# EAGLE design sterileplate (EAGLE 9.5.2)
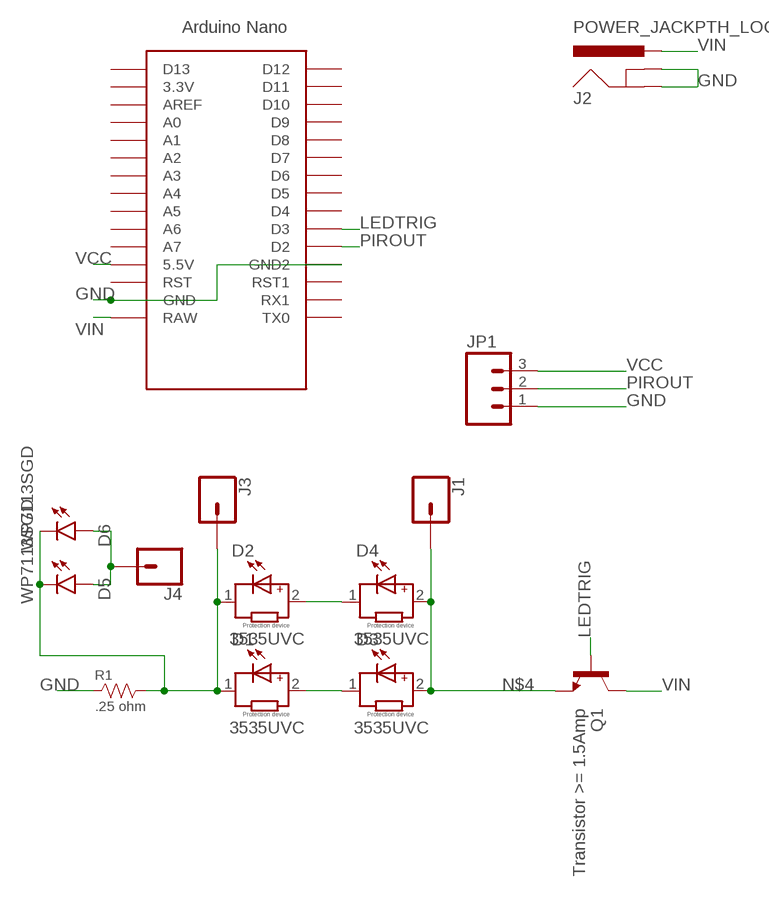
[diagram p0: schematic, sheet 1]

## Parts
D1  3535UVC  WL-SWTC_3535_158353060_6000K  [WL-SWTC_3535]
D2  3535UVC  WL-SWTC_3535_158353060_6000K  [WL-SWTC_3535]
D3  3535UVC  WL-SWTC_3535_158353060_6000K  [WL-SWTC_3535]
D4  3535UVC  WL-SWTC_3535_158353060_6000K  [WL-SWTC_3535]
D5  WP7113SGD  [RADIAL_5MM]
D6  WP7113SGD  [RADIAL_5MM]
J1  CONN_01PTH_2MM  [1X01_2MM]
J2  POWER_JACKPTH_LOCK  [POWER_JACK_PTH_LOCK]
J3  CONN_01PTH_2MM  [1X01_2MM]
J4  CONN_01PTH_2MM  [1X01_2MM]
JP1  M03PTH  [1X03]
Q1  Transistor >= 1.5Amp  TRANSISTOR_NPNTO92  [TO-92]
R1  .25 ohm  RESISTOR-AXL-REGULAR  [AXL-REGULAR]
U$1  NANO  [NANO]

## Nets
GND: J2.GND J2.GNDBREAK JP1.1 R1.1 U$1.GND U$1.GND1(GND2)
LEDTRIG: Q1.2(B) U$1.D3
N$1: D2.2 D4.1
N$2: D1.2 D3.1
N$4: D3.2 D4.2 J1.1 Q1.1(E)
N$6: D5.A D6.A J4.1
N$7: D1.1 D2.1 D5.C D6.C J3.1 R1.2
PIROUT: JP1.2 U$1.D2
VCC: JP1.3 U$1.5V(5.5V)
VIN: J2.PWR Q1.3(C) U$1.RAW
Unconnected: U$1.3.3V U$1.A0 U$1.A1 U$1.A2 U$1.A3 U$1.A4 U$1.A5 U$1.A6 U$1.A7 U$1.AREF U$1.D4 U$1.D5 U$1.D6 U$1.D7 U$1.D8 U$1.D9 U$1.D10 U$1.D11 U$1.D12 U$1.D13 U$1.ICSP1 U$1.ICSP2 U$1.ICSP3 U$1.ICSP4 U$1.ICSP5 U$1.ICSP6 U$1.RST U$1.RST1 U$1.RX1 U$1.TX0

## Library data of the parts
D1-D4 = Wurth_Elektronik_Optoelectronics_rev19a:WL-SWTC_3535: WL-SWTC SMD White Top view Ceramic LED Size 3535, waterclear dome lens Characteristics Fast switching No IR radiation High brightness Minimal side emission Waterclear silicone lens Top view Flexible coupling with secondary optic Various color temperatures Compact footprint Thermal resistance junction to solder point: 8 °K/W LED junction temperature: 150 °C Moisture Sensitivity Level: 2 Applications Indoor lighting: Spot light, Down light Outdoor lighting: Street light, Security light, Tunnel light, Parking lots light Industrial lighting: High-bay light, Low-bay light Consumer lighting: Torch light Agricultural equipment lighting Signal and symbol luminaries <http://katalog.we-online.de/media/images/eipal/WL-SWTC_pf2.jpg> Details see: http://katalog.we-online.de/en/led/WL-SWTC/158353060?m Created 2015-01-06, 2015 (C) Wurth Elektronik; OC_NEWARK: unknown
D5 D6 = LED:WP7113SGD: LED GREEN DIFFUSED T-1 3/4 T/H Manufacturer's datasheet <http://www.kingbrightusa.com/images/catalog/SPEC/WP7113SGD.pdf>; CREATED_BY: PCBLayout.com; DIGIKEY_PART_NUMBER: 754-1735-ND; MANUFACTURER: Kingbright; MPN: WP7113SGD; PACKAGE: RADIAL 5MM
J1 J3 J4 = SparkFun-Connectors:CONN_01: Single connection point. Often used as Generic Header-pin footprint for 0.1 inch spaced/style header connections On any of the 0.1 inch spaced packages, you can populate with these: Break Away Headers - Straight <https://www.sparkfun.com/products/116> (PRT-00116) Break Away Male Headers - Right Angle <https://www.sparkfun.com/products/553> (PRT-00553) Female Headers <https://www.sparkfun.com/products/115> (PRT-00115) Break Away Headers - Machine Pin <https://www.sparkfun.com/products/117> (PRT-00117) Break Away Female Headers - Swiss Machine Pin <https://www.sparkfun.com/products/743> (PRT-00743) This device is also useful as a general connection point to wire up your design to another part of your project. Our various solder wires solder well into these plated through hole pads. Hook-Up Wire - Assortment (Stranded, 22 AWG) <https://www.sparkfun.com/products/11375> (PRT-11375) Hook-Up Wire - Assortment (Solid Core, 22 AWG) <https://www.sparkfun.com/products/11367> (PRT-11367) View the entire wire category on our website here <https://www.sparkfun.com/categories/141> Special notes: SMTSO-256-ET is a "flush mount" nut for a 4-40 screw. We mostly use this on specialty testbeds; it is a nice way to connect hardware to your PCB at an adjustable hieght. Also note, the SNAP packages are for using a snappable style connector. We sell a baggie of snaps and they are also used on two LilyPad designs: Snap Assortment - 30 pack (male and female) <https://www.sparkfun.com/products/11347> (DEV-11347) LilyPad Arduino SimpleSnap <https://www.sparkfun.com/products/10941> (DEV-10941) LilyPad SimpleSnap Protoboard <https://www.sparkfun.com/products/10940> (DEV-10940)
J2 = SparkFun:POWER_JACK: Power Jack This is the standard 5.5mm barrel jack for power. The PTH is the most common, proven, reliable, footprint. All others are experimental. The Slot footprint only works if the mill layer is transmitted to the PCB fab house so be warned. Spark Fun Electronics SKU : PRT-00119. Mating wall wart : TOL-00298 (and others); MF: GCT (GLOBAL CONNECTOR TECHNOLOGY); MPN: DCJ235-05-A-K1-K; OC_NEWARK: 75Y6645
JP1 = SparkFun:M03: Header 3 Standard 3-pin 0.1" header. Use with straight break away headers (SKU : PRT-00116), right angle break away headers (PRT-00553), swiss pins (PRT-00743), machine pins (PRT-00117), and female headers (PRT-00115). Molex polarized connector foot print use with SKU : PRT-08232 with associated crimp pins and housings.
Q1 = SparkFun:TRANSISTOR_NPN: Transistor NPN BJT configuration in SOT23 package. MMBT2222 is the common NPN we use. Double check BCE configuration again layout.; OC_NEWARK: unknown
R1 = FaBo-Resistors:RESISTOR: RESISTOR; OC_NEWARK: unknown
U$1 = Arduino-clone:NANO: Arduino Nano; OC_NEWARK: unknown

## Board
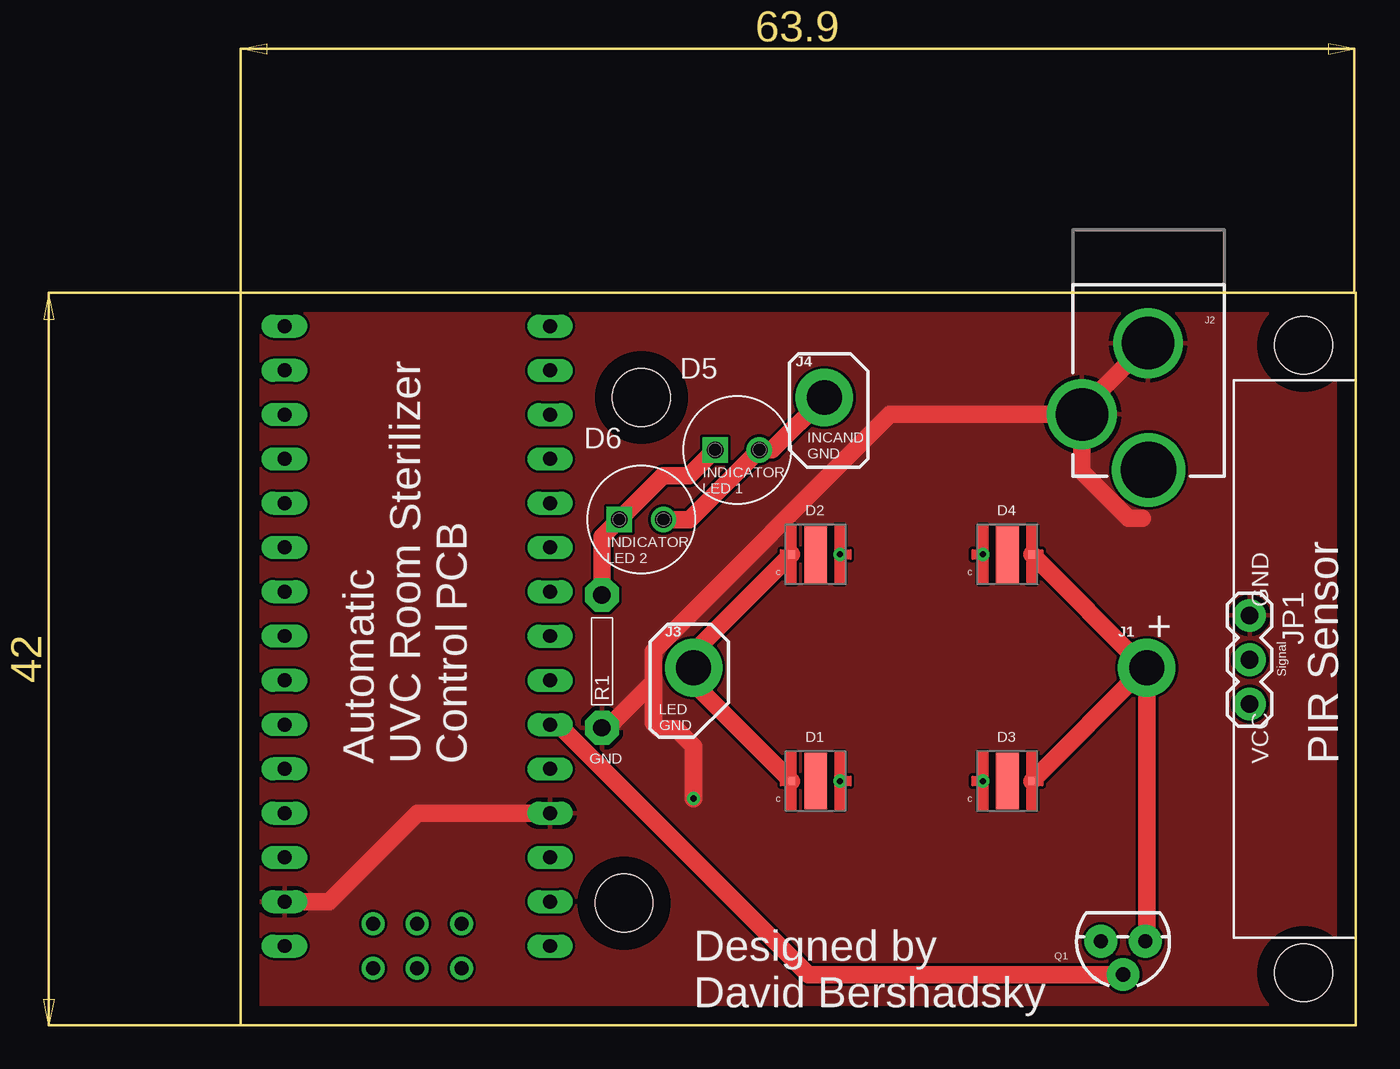
[diagram p1: board, top side]
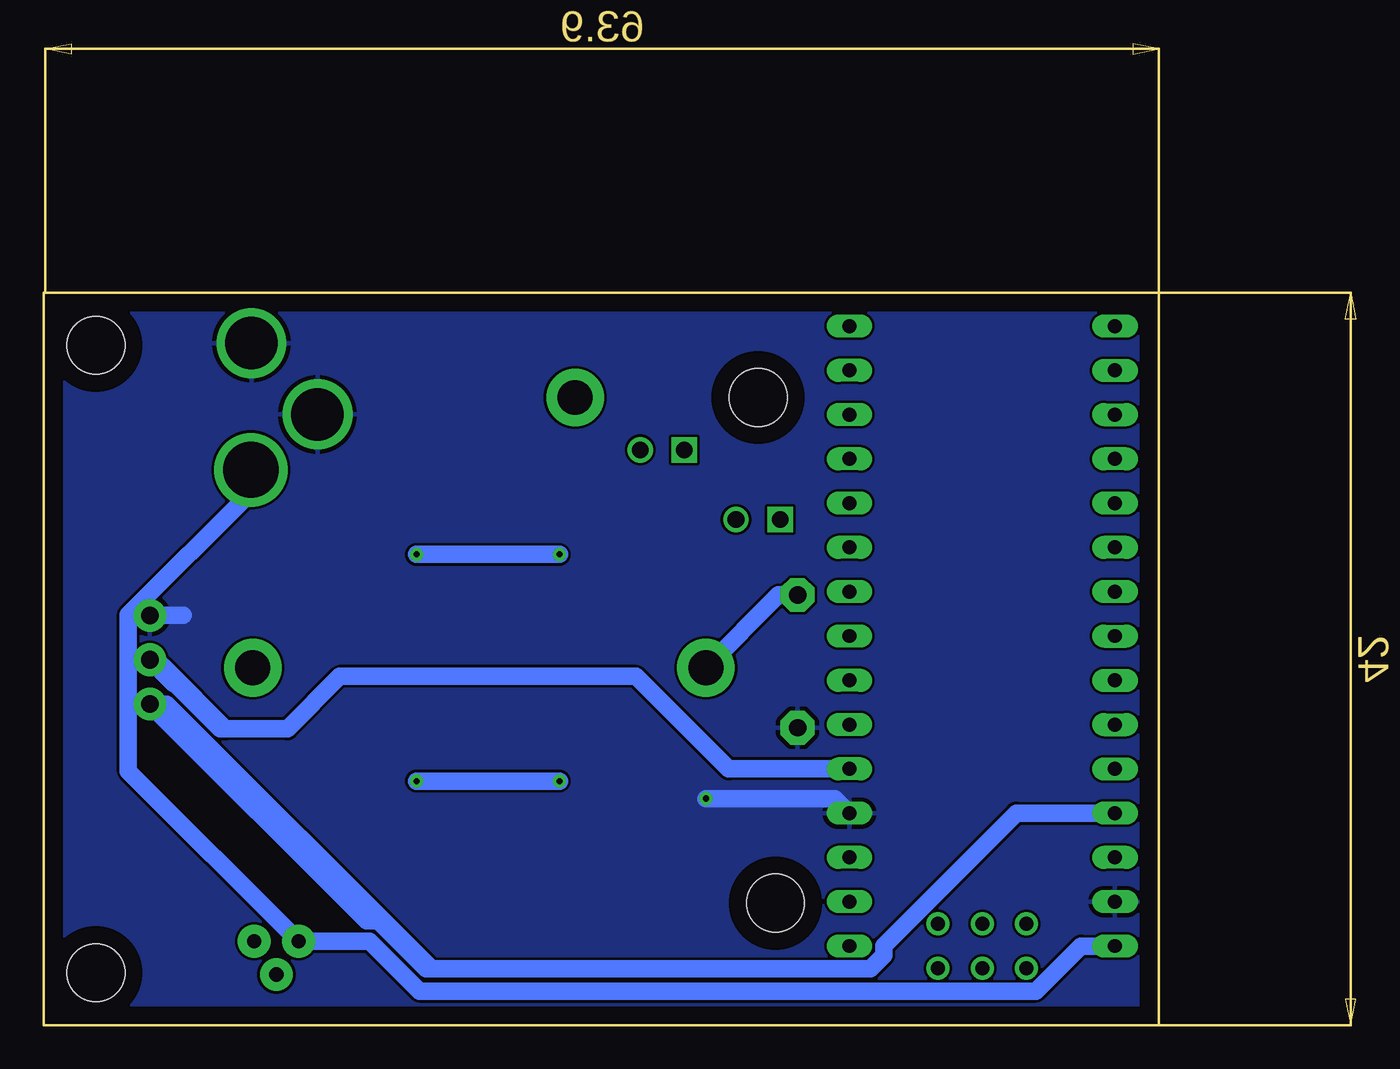
[diagram p2: board, bottom side, seen from below]

Size 64 x 42 mm. Coordinates in mm from the lower left corner, seen from the top.
Outline: 0,42 64,42 64,0 0,0 0,42
Copper layers (1*16): Top 0.035mm / dielectric 1.5mm / Bottom 0.035mm
Design rules "default": minimum track width 6mil, minimum drill 0.35mm, track to track 6mil, track to pad 6mil, pad to pad 6mil, via to via 6mil, smd to smd 6mil, copper to edge 40mil, drill to drill 6mil, minimum pad ring 10mil, minimum via ring 8mil, stop-mask expansion 4mil, vias tented up to drill 0mil, thermal gap 10mil
Holes 3.3 mm at 22,7 23,36 61,3 61,39

### Footprints (pad centres in the part's own frame; a part is rotated, then mirrored left to right if it is on the bottom)
WL-SWTC_3535 = smd 0.4 x 0.5: 1 -1.4,0; 2 1.4,0 | smd 1.3 x 3.25: 3 0,0
RADIAL_5MM = drill 0.95 pad 1.43: A 1.27,0 | drill 0.95 pad 1.43 square: C -1.27,0
1X01_2MM = drill 2 pad 3.302: 1 0,0
POWER_JACK_PTH_LOCK = drill 2.997: GND 0.025,6.608; GNDBREAK 3.812,10.7 | drill 3.2: PWR 0,13.878
1X03 = drill 1.016 pad 1.88: 1 0,0; 2 2.54,0; 3 5.08,0
TO-92 = drill 0.813 pad 1.88: 1 -1.27,0; 2 0,1.905; 3 1.27,0
AXL-REGULAR = drill 1 pad 1.93 octagon: 1 -3.81,0; 2 3.81,0
NANO = drill 0.8 long: 3.3V -10.16,24.13; 5V -10.16,-1.27; A0 -10.16,19.05; A1 -10.16,16.51; A2 -10.16,13.97; A3 -10.16,11.43; A4 -10.16,8.89; A5 -10.16,6.35; A6 -10.16,3.81; A7 -10.16,1.27; AREF -10.16,21.59; D2 5.08,1.27; D3 5.08,3.81; D4 5.08,6.35; D5 5.08,8.89; D6 5.08,11.43; D7 5.08,13.97; D8 5.08,16.51; D9 5.08,19.05; D10 5.08,21.59; D11 5.08,24.13; D12 5.08,26.67; D13 -10.16,26.67; GND -10.16,-6.35; GND1 5.08,-1.27; RAW -10.16,-8.89; RST -10.16,-3.81; RST1 5.08,-3.81; RX1 5.08,-6.35; TX0 5.08,-8.89 | drill 0.8: ICSP1 -5.08,-10.16; ICSP2 -5.08,-7.62; ICSP3 -2.54,-10.16; ICSP4 -2.54,-7.62; ICSP5 0,-10.16; ICSP6 0,-7.62

### Placement (x,y rotation side)
D1  33,14 0 top
D2  33,27 0 top
D3  44,14 0 top
D4  44,27 0 top
D5  28.5,33 0 top
D6  23,29 0 top
J1  52,20.5 0 top
J2  52.1,45.73 180 top
J3  26,20.5 0 top
J4  33.5,36 0 top
JP1  57.9,23.5 270 top
Q1  50.64,4.81 180 top
R1  20.74,20.87 90 top
U$1  12.68,13.43 0 top

### Tracks (layer width: path | path; a pad name or v marks a point on that pad's centre or on a via)
GND  (via drill 0.35)
  Top 1.016: J2.GND 48.29,35.34 J2.GNDBREAK | 51.74,29.08 50.95,29.08 48.29,31.75 J2.GNDBREAK | 23.69,19.69 23.69,21.46 37.26,35.03 J2.GNDBREAK | 23.69,19.69 21,17 | U$1.GND 5.08,7.08 10.16,12.16 U$1.GND1 | v26,13 26,16 25,17 24,17 23.69,17.31 23.69,19.69
  Bottom 1.016: U$1.GND1 18.6,13 v26,13 | JP1.1 56,23.5
  pour Bottom: 0,42 64,42 64,0 0,0
  pour Top: 0,42 63.9,42 63.9,0 0,0
LEDTRIG
  Top 1.016: U$1.D3 18.26,17.24 32.6,2.91 42,2.91 Q1.2
N$1  (via drill 0.35)
  Bottom 1.016: D4.1 D2.2
  other vias: 34.4,27 42.6,27
N$2  (via drill 0.35)
  Bottom 1.016: D1.2 D3.1
  other vias: 42.6,14 34.4,14
N$4
  Top 1.016: D4.2 51.9,20.5 | 51.9,20.5 J1.1 52,4.9 Q1.1 | D3.2 51.9,20.5
N$6
  Top 1.016: D6.A 25.77,29 D5.A 30.5,33 J4.1
N$7
  Top 1.016: D1.1 26,19.6 J3.1 26,21.4 D2.1 | D5.C 25.73,31.5 24.23,31.5 D6.C 20.74,28.01 R1.2
  Bottom 1.016: J3.1 21.82,24.68 R1.2
PIROUT
  Bottom 1.016: U$1.D2 24.7,14.7 30,20 47,20 50,17 53.58,17 | 57.13,20.31 56.89,20.31 | 53.58,17 56.89,20.31 | 56.89,20.31 57.54,20.96 JP1.2 56.53,19.59 56.46,19.59 53.87,17 53.58,17
VCC
  Bottom 1.016: U$1.5V 8.19,12.16 15.79,4.56 15.79,4 16.56,3.23 41.75,3.23 | 41.75,3.23 42.05,3.23 44.8,5.98 45.46,5.98 JP1.3 56.94,18.42 41.75,3.23
VIN
  Bottom 1.016: U$1.RAW 4.47,4.54 7.06,1.96 42.43,1.96 45.28,4.81 Q1.3 59.13,14.57 59.13,23.54 52.1,30.58 J2.PWR

### Text on the board
tPlace: GND | Signal | VCC | PIR Sensor
tNames: INCAND / GND | INDICATOR / LED 1 | INDICATOR / LED 2 | + | LED / GND | Automatic / UVC Room Sterilizer / Control PCB | GND | Designed by / David Bershadsky